# Altium schematic sheet MotorDriver_Schematics.SchDoc
size A3; SheetNumber: 2; SheetTotal: 3
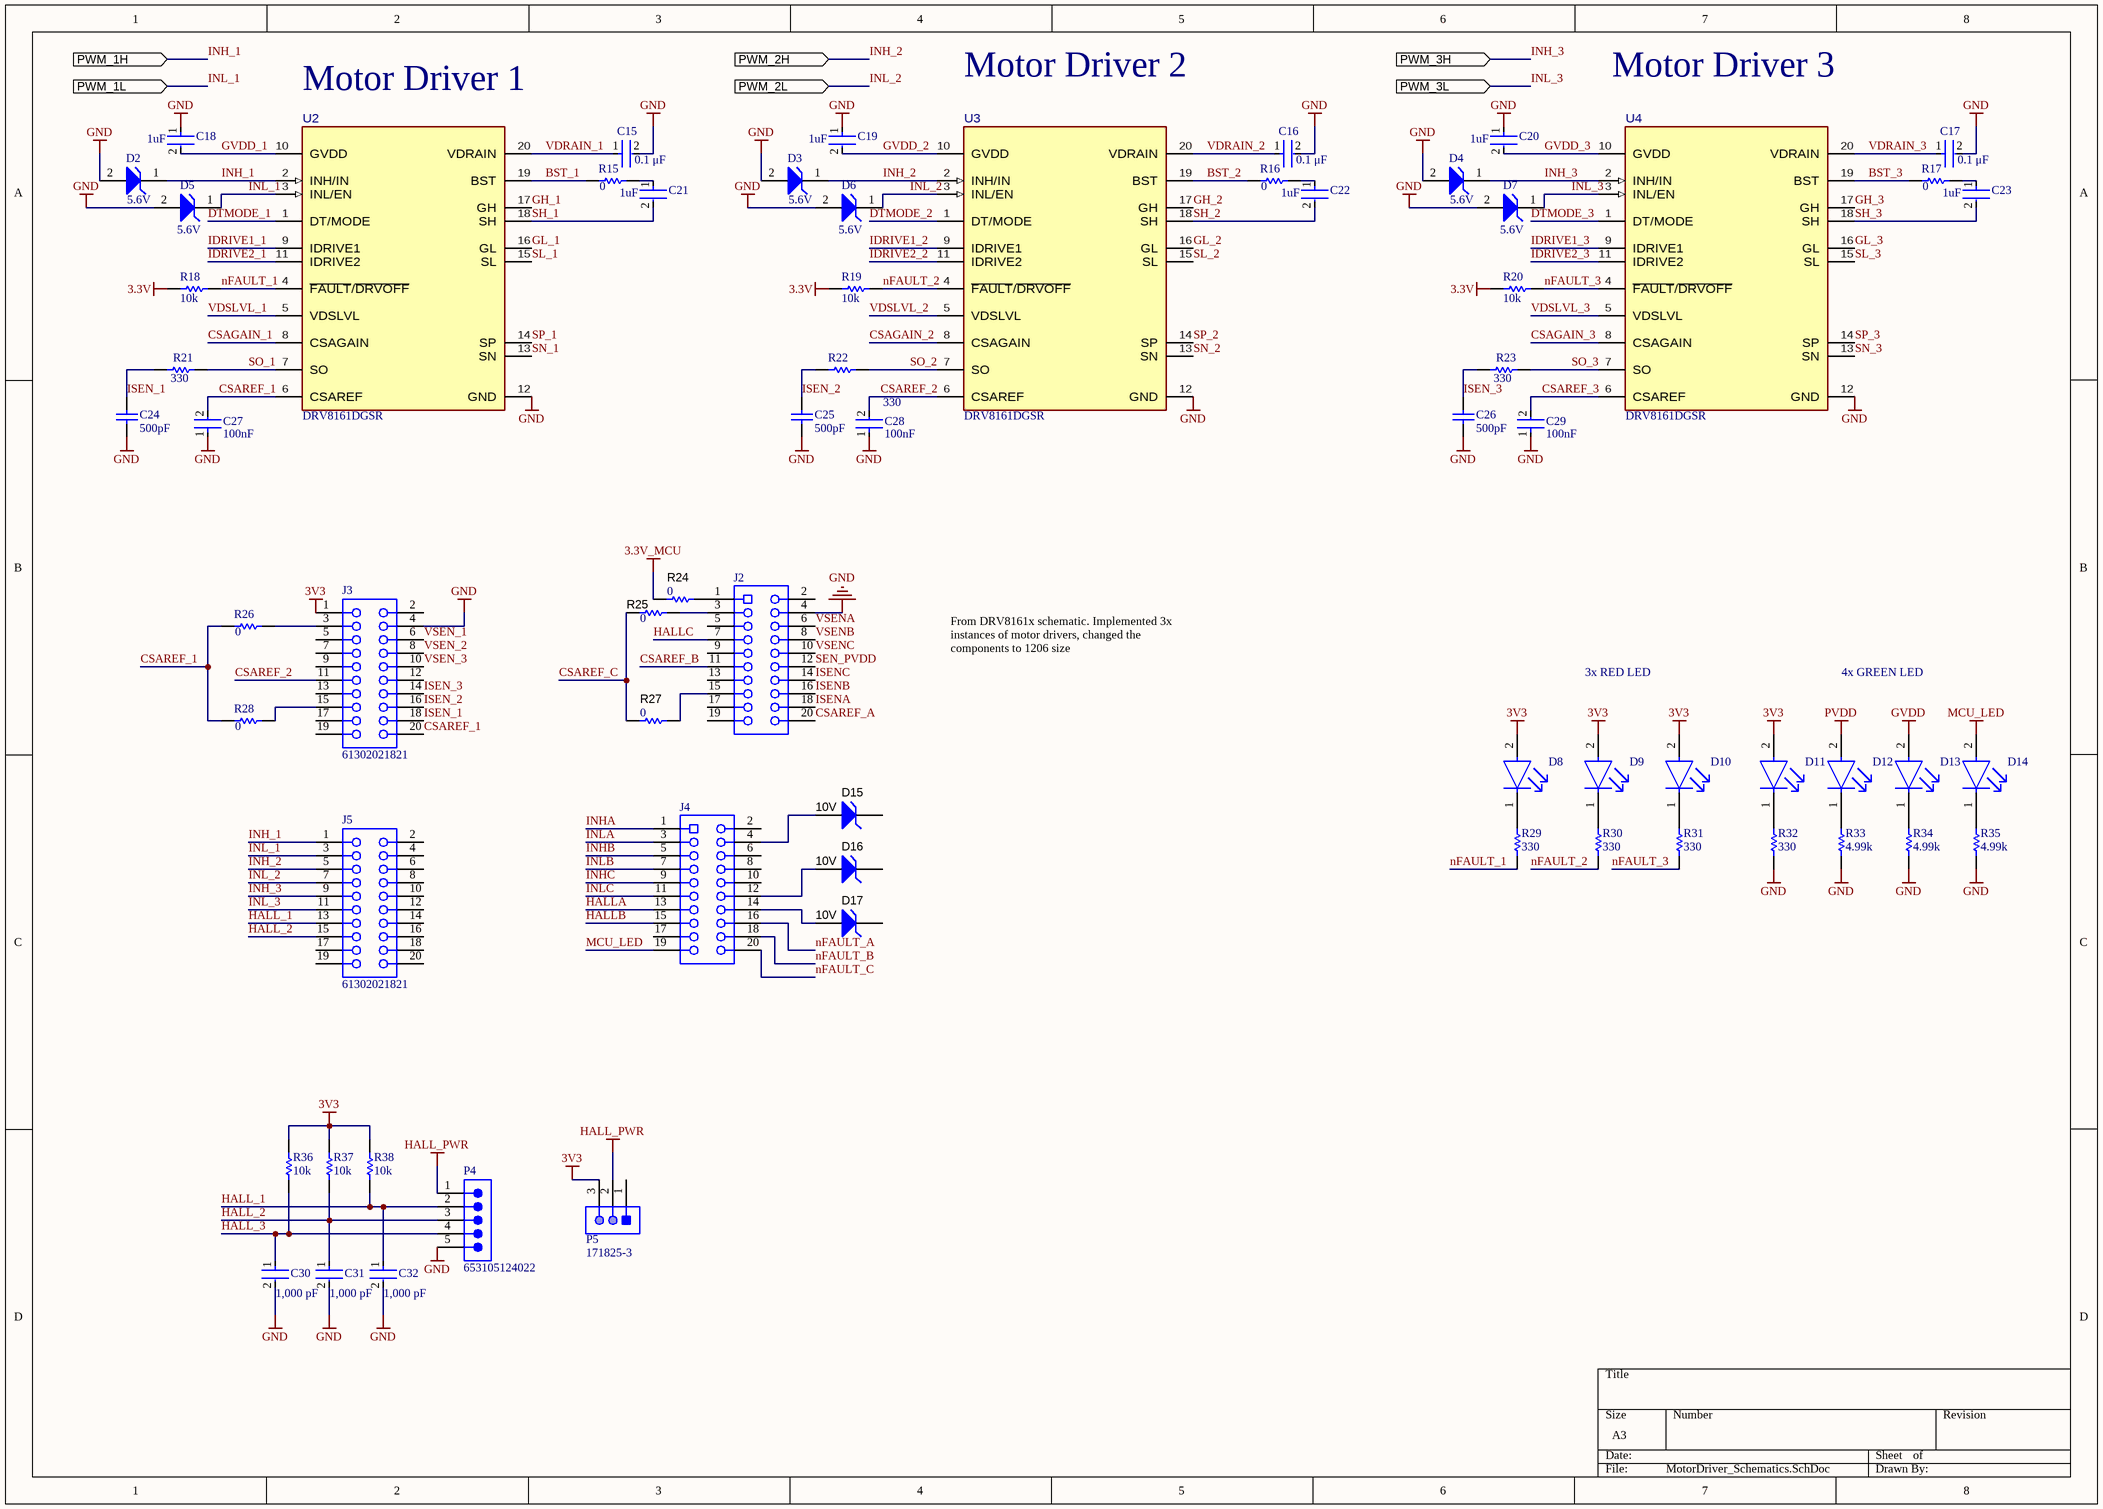
[diagram p0: MotorDriver_Schematics.SchDoc]

## Parts
C15  Capacitance: 0.1 μF  [FP-C1206C-EB-MFG]  (hidden comment: C1206C104K1RACTU)
C16  Capacitance: 0.1 μF  [FP-C1206C-EB-MFG]  (hidden comment: C1206C104K1RACTU)
C17  Capacitance: 0.1 μF  [FP-C1206C-EB-MFG]  (hidden comment: C1206C104K1RACTU)
C18  Capacitance: 1uF  [FP-1206-L_3_2_0_2-W_1_6_0-IPC_A]  (hidden comment: 12063C105KAT2A)
C19  Capacitance: 1uF  [FP-1206-L_3_2_0_2-W_1_6_0-IPC_A]  (hidden comment: 12063C105KAT2A)
C20  Capacitance: 1uF  [FP-1206-L_3_2_0_2-W_1_6_0-IPC_A]  (hidden comment: 12063C105KAT2A)
C21  Capacitance: 1uF  [FP-1206-L_3_2_0_2-W_1_6_0-IPC_A]  (hidden comment: 12063C105KAT2A)
C22  Capacitance: 1uF  [FP-1206-L_3_2_0_2-W_1_6_0-IPC_A]  (hidden comment: 12063C105KAT2A)
C23  Capacitance: 1uF  [FP-1206-L_3_2_0_2-W_1_6_0-IPC_A]  (hidden comment: 12063C105KAT2A)
C24  Parameter 1: 500pF  [CAPC1005X56X25NL10T15]  (hidden comment: 04025C501KAT2A)
C25  Parameter 1: 500pF  [CAPC1005X56X25NL10T15]  (hidden comment: 04025C501KAT2A)
C26  Parameter 1: 500pF  [CAPC1005X56X25NL10T15]  (hidden comment: 04025C501KAT2A)
C27  Capacitance: 100nF  [FP-1206-L_3_2_0_2-W_1_6_0-MFG]  (hidden comment: 12061C104KAZ2A)
C28  Capacitance: 100nF  [FP-1206-L_3_2_0_2-W_1_6_0-MFG]  (hidden comment: 12061C104KAZ2A)
C29  Capacitance: 100nF  [FP-1206-L_3_2_0_2-W_1_6_0-MFG]  (hidden comment: 12061C104KAZ2A)
C30  Capacitance: 1,000 pF  [FP-C1206C-EB-MFG]  (hidden comment: C1206C102J1GACTU)
C31  Capacitance: 1,000 pF  [FP-C1206C-EB-MFG]  (hidden comment: C1206C102J1GACTU)
C32  Capacitance: 1,000 pF  [FP-C1206C-EB-MFG]  (hidden comment: C1206C102J1GACTU)
D2  VZ Typ (V): 5.6V  [ONSC-SOD-123-2-425-04_V]  (hidden comment: MMSZ5232BT1G)
D3  VZ Typ (V): 5.6V  [ONSC-SOD-123-2-425-04_V]  (hidden comment: MMSZ5232BT1G)
D4  VZ Typ (V): 5.6V  [ONSC-SOD-123-2-425-04_V]  (hidden comment: MMSZ5232BT1G)
D5  VZ Typ (V): 5.6V  [ONSC-SOD-123-2-425-04_V]  (hidden comment: MMSZ5232BT1G)
D6  VZ Typ (V): 5.6V  [ONSC-SOD-123-2-425-04_V]  (hidden comment: MMSZ5232BT1G)
D7  VZ Typ (V): 5.6V  [ONSC-SOD-123-2-425-04_V]  (hidden comment: MMSZ5232BT1G)
D8  HSMS-C150  [FP-HSMS-C150-MFG]  (value not drawn)
D9  HSMS-C150  [FP-HSMS-C150-MFG]  (value not drawn)
D10  HSMS-C150  [FP-HSMS-C150-MFG]  (value not drawn)
D11  LTST-C171GKT  [FP-LTST-C171GKT-MFG]  (value not drawn)
D12  LTST-C171GKT  [FP-LTST-C171GKT-MFG]  (value not drawn)
D13  LTST-C171GKT  [FP-LTST-C171GKT-MFG]  (value not drawn)
D14  LTST-C171GKT  [FP-LTST-C171GKT-MFG]  (value not drawn)
D15  value 10V  [SOD-123]  (hidden comment: DDZ10C-7)
D16  value 10V  [SOD-123]  (hidden comment: DDZ10C-7)
D17  value 10V  [SOD-123]  (hidden comment: DDZ10C-7)
J2  SSQ-110-03-G-D  [Samtec_SSQ-110-03-x-D]  (value not drawn)
J3  61302021821  [61302021821]
J4  SSQ-110-03-G-D  [Samtec_SSQ-110-03-x-D]  (value not drawn)
J5  61302021821  [61302021821]
P4  653105124022  [653105124022]
P5  171825-3  [TECO-171825-3_V]
R15  Resistance: 0  [RESC3216X70X50NL05T20]  (hidden comment: ERJ-8GEY0R00V)
R16  Resistance: 0  [RESC3216X70X50NL05T20]  (hidden comment: ERJ-8GEY0R00V)
R17  Resistance: 0  [RESC3216X70X50NL05T20]  (hidden comment: ERJ-8GEY0R00V)
R18  Resistance: 10k  [RESC3116X65X50NL20T20]  (hidden comment: CRCW120610K0FKEAHP)
R19  Resistance: 10k  [RESC3116X65X50NL20T20]  (hidden comment: CRCW120610K0FKEAHP)
R20  Resistance: 10k  [RESC3116X65X50NL20T20]  (hidden comment: CRCW120610K0FKEAHP)
R21  Resistance: 330  [RESC3216X70X50NL05T20]  (hidden comment: ERJ-8GEYJ331V)
R22  Resistance: 330  [RESC3216X70X50NL05T20]  (hidden comment: ERJ-8GEYJ331V)
R23  Resistance: 330  [RESC3216X70X50NL05T20]  (hidden comment: ERJ-8GEYJ331V)
R24  ValueDisplayed: 0  [0603L]  (hidden comment: CRCW06030000Z0EA)
R25  ValueDisplayed: 0  [0603L]  (hidden comment: CRCW06030000Z0EA)
R26  Resistance: 0  [RESC3216X70X50NL05T20]  (hidden comment: ERJ-8GEY0R00V)
R27  ValueDisplayed: 0  [0603L]  (hidden comment: CRCW06030000Z0EA)
R28  Resistance: 0  [RESC3216X70X50NL05T20]  (hidden comment: ERJ-8GEY0R00V)
R29  Resistance: 330  [RESC3216X70X50NL05T20]  (hidden comment: ERJ-8GEYJ331V)
R30  Resistance: 330  [RESC3216X70X50NL05T20]  (hidden comment: ERJ-8GEYJ331V)
R31  Resistance: 330  [RESC3216X70X50NL05T20]  (hidden comment: ERJ-8GEYJ331V)
R32  Resistance: 330  [RESC3216X70X50NL05T20]  (hidden comment: ERJ-8GEYJ331V)
R33  Resistance: 4.99k  [RESC3216X60X45ML10T20]  (hidden comment: CRCW12064K99FKEA)
R34  Resistance: 4.99k  [RESC3216X60X45ML10T20]  (hidden comment: CRCW12064K99FKEA)
R35  Resistance: 4.99k  [RESC3216X60X45ML10T20]  (hidden comment: CRCW12064K99FKEA)
R36  Resistance: 10k  [RESC3116X65X50NL20T20]  (hidden comment: CRCW120610K0FKEAHP)
R37  Resistance: 10k  [RESC3116X65X50NL20T20]  (hidden comment: CRCW120610K0FKEAHP)
R38  Resistance: 10k  [RESC3116X65X50NL20T20]  (hidden comment: CRCW120610K0FKEAHP)
U2  DRV8161DGSR  [DGS0020A-MFG]
U3  DRV8161DGSR  [DGS0020A-MFG]
U4  DRV8161DGSR  [DGS0020A-MFG]

## Ports
PWM_1H (in), PWM_1L (in), PWM_2H (in), PWM_2L (in), PWM_3H (in), PWM_3L (in)

## Nets
3.3V: R18.1 R19.1 R20.1
3.3V_MCU: R24.1
3V3: D8.2(A) D9.2(A) D10.2(A) D11.2(A) J3.1 P5.3 R36.2 R37.2 R38.2
GND: C15.2 C16.2 C17.2 C18.1 C19.1 C20.1 C24.1 C25.1 C26.1 C27.1 C28.1 C29.1 C30.2 C31.2 C32.2 D2.2(A) D3.2(A) D4.2(A) D5.2(A) D6.2(A) D7.2(A) J2.4 J3.4 P4.5 R32.1 R33.1 R34.1 R35.1 U2.12(GND) U3.12(GND) U4.12(GND)
GVDD: D13.2(A)
HALL_PWR: P4.1 P5.2
MCU_LED: D14.2(A) J4.19
PVDD: D12.2(A)
BST_1: R15.1 U2.19(BST)
BST_2: R16.1 U3.19(BST)
BST_3: R17.1 U4.19(BST)
CSAGAIN_1: U2.8(CSAGAIN)
CSAGAIN_2: U3.8(CSAGAIN)
CSAGAIN_3: U4.8(CSAGAIN)
CSAREF_1: C27.2 J3.20 R26.1 R28.1 U2.6(CSAREF)
CSAREF_2: C28.2 J3.11 U3.6(CSAREF)
CSAREF_3: C29.2 U4.6(CSAREF)
CSAREF_A: J2.20
CSAREF_B: J2.11
CSAREF_C: R25.1 R27.1
DTMODE_1: U2.1(DT/MODE)
DTMODE_2: U3.1(DT/MODE)
DTMODE_3: U4.1(DT/MODE)
GH_1: U2.17(GH)
GH_2: U3.17(GH)
GH_3: U4.17(GH)
GL_1: U2.16(GL)
GL_2: U3.16(GL)
GL_3: U4.16(GL)
GVDD_1: C18.2 U2.10(GVDD)
GVDD_2: C19.2 U3.10(GVDD)
GVDD_3: C20.2 U4.10(GVDD)
HALL_1: C32.1 J5.13 P4.2 R38.1
HALL_2: C31.1 J5.15 P4.3 R37.1
HALL_3: C30.1 P4.4 R36.1
HALLA: J4.13
HALLB: J4.15
HALLC: J2.7
IDRIVE1_1: U2.9(IDRIVE1)
IDRIVE1_2: U3.9(IDRIVE1)
IDRIVE1_3: U4.9(IDRIVE1)
IDRIVE2_1: U2.11(IDRIVE2)
IDRIVE2_2: U3.11(IDRIVE2)
IDRIVE2_3: U4.11(IDRIVE2)
INH_1: D2.1(K) J5.1 U2.2(INH/IN) ; port PWM_1H
INH_2: D3.1(K) J5.5 U3.2(INH/IN) ; port PWM_2H
INH_3: D4.1(K) J5.9 U4.2(INH/IN) ; port PWM_3H
INHA: J4.1
INHB: J4.5
INHC: J4.9
INL_1: D5.1(K) J5.3 U2.3(INL/EN) ; port PWM_1L
INL_2: D6.1(K) J5.7 U3.3(INL/EN) ; port PWM_2L
INL_3: D7.1(K) J5.11 U4.3(INL/EN) ; port PWM_3L
INLA: J4.3
INLB: J4.7
INLC: J4.11
ISEN_1: C24.2 J3.18 R21.1
ISEN_2: C25.2 J3.16 R22.2
ISEN_3: C26.2 J3.14 R23.1
ISENA: J2.18
ISENB: J2.16
ISENC: J2.14
nFAULT_1: R18.2 R29.1 U2.4(~{FAULT}/~{DRVOFF})
nFAULT_2: R19.2 R30.1 U3.4(~{FAULT}/~{DRVOFF})
nFAULT_3: R20.2 R31.1 U4.4(~{FAULT}/~{DRVOFF})
nFAULT_A: J4.16
nFAULT_B: J4.18
nFAULT_C: J4.20
SEN_PVDD: J2.12
SH_1: C21.2 U2.18(SH)
SH_2: C22.2 U3.18(SH)
SH_3: C23.2 U4.18(SH)
SL_1: U2.15(SL)
SL_2: U3.15(SL)
SL_3: U4.15(SL)
SN_1: U2.13(SN)
SN_2: U3.13(SN)
SN_3: U4.13(SN)
SO_1: R21.2 U2.7(SO)
SO_2: R22.1 U3.7(SO)
SO_3: R23.2 U4.7(SO)
SP_1: U2.14(SP)
SP_2: U3.14(SP)
SP_3: U4.14(SP)
VDRAIN_1: C15.1 U2.20(VDRAIN)
VDRAIN_2: C16.1 U3.20(VDRAIN)
VDRAIN_3: C17.1 U4.20(VDRAIN)
VDSLVL_1: U2.5(VDSLVL)
VDSLVL_2: U3.5(VDSLVL)
VDSLVL_3: U4.5(VDSLVL)
VSEN_1: J3.6
VSEN_2: J3.8
VSEN_3: J3.10
VSENA: J2.6
VSENB: J2.8
VSENC: J2.10
NetC21_1: C21.1 R15.2
NetC22_1: C22.1 R16.2
NetC23_1: C23.1 R17.2
NetD8_1: D8.1(C) R29.2
NetD9_1: D9.1(C) R30.2
NetD10_1: D10.1(C) R31.2
NetD11_1: D11.1(C) R32.2
NetD12_1: D12.1(C) R33.2
NetD13_1: D13.1(C) R34.2
NetD14_1: D14.1(C) R35.2
NetD15_2: D15.2(A) J4.4
NetD16_2: D16.2(A) J4.12
NetD17_2: D17.2(A) J4.14
NetJ2_1: J2.1 R24.2
NetJ2_3: J2.3 R25.2
NetJ2_15: J2.15 R27.2
NetJ3_3: J3.3 R26.2
NetJ3_15: J3.15 R28.2

Not connected (* = marked no-connect by the designer): D15 1(K); D16 1(K); D17 1(K); J2 2 5 9 13 17 19; J3 2 5 7 9 12 13 17 19; J4 2 6 8 10 17; J5 2 4 6 8 10 12 14 16 17 18 19 20; P5 1

## Notes on the sheet
- Motor Driver 1
- Motor Driver 2
- Motor Driver 3
- From DRV8161x schematic. Implemented 3x instances of motor drivers, changed the components to 1206 size
- 3x RED LED
- 4x GREEN LED

## Library data of the parts
C15-C17 = CMP-03020-000153-1: CAP CER 0.1UF 100V X7R 1206; Manufacturer: KEMET; Value: 0.10 μF; Tolerance: 0.1; Material: Ceramic; Temperature Coefficient: 15%; Automotive Grade: Grade 0; Voltage Rating: 100 V; Automotive: Yes; Ipc Land Pattern Name: CAPC320160X78; Device Class L1: Passive Components; ComponentLink2Description: Datasheet; Temperature Range Low: -55°C; Category: Cap; Octopart: https://octopart.com/c1206c104k1ractu-kemet-89521; Height: 0.88mm; Lead Free: Yes; Digikey Description: CAP CER 0.1UF 100V X7R 1206; Mouser Description: CAP CER 0.1UF 100V X7R 1206; Device Class L3: Ceramic Capacitors; Device Class L2: Capacitors; ComponentLink2URL: https://content.kemet.com/datasheets/KEM_C1007_X8R_ULTRA_150C_SMD.pdf; Temperature Range High: +150°C; Temperature Characteristic: X7R; Manufacturer Part Number: C1206C104K1RACTU; RoHS: TRUE; Package: C1206C-EB; Temperature: -55°C to +150°C
C18-C23 = CMP-04427-000096-1: General Purpose Ceramic Capacitor, 1206, 1uF, 10%, X7R, 15%, 25V; Dissipation Factor: 3%; Insulation Resistance: 100GR; Case Code (Metric): 3216; Length: 3.2mm; Size: 1.78mm; Radiation Hardening: No; Construction: Flat; Packaging: Tape and Reel; Voltage Rating (DC): 25V; Case Code (Imperial): 1206; Package Quantity: 1; Tolerance: 10%; Voltage Rating: 25V; Lead Free: Lead Free; Height: 1.78mm; Thickness: 0.07inch; Width: 1.6mm; Dielectric: X7R; Voltage: 25V; Contact Plating: Tin; Min Operating Temperature: -55°C; Number of Pins: 2; Series: -; Depth: 1.6mm; REACH SVHC: No SVHC; Case/Package: 1206; RoHS Compliant: Yes; Max Operating Temperature: 125°C; Termination: SMD/SMT; Mount: Surface Mount
C24-C26 = CMP-2008-02932-1: Manufacturer: AVX Interconnect / Elco; Part Number: 04025C501KAT2A
C27-C29 = CMP-04427-004798-1: General Purpose Ceramic Capacitor, 1206, 100nF, 10%, X7R, 15%, 100V; Features: Soft Termination; Termination: SMD/SMT; Mount: Surface Mount; Tolerance: 10%; Voltage Rating: 100V; Length: 3.2mm; Case/Package: 1206; Case Code (Metric): 3216; RoHS Compliant: Yes; Package Quantity: 1; Max Operating Temperature: 125°C; Voltage Rating (DC): 100V; Min Operating Temperature: -55°C; Number of Pins: 2; Packaging: Tape and Reel; Width: 0.063inch; REACH SVHC: No SVHC; Lead Free: Lead Free; Construction: Flat; Radiation Hardening: No; Case Code (Imperial): 1206; Thickness: 0.05inch; Series: FLEXITERM®; Depth: 1.6mm; Dielectric: X7R
C30-C32 = CMP-03020-000955-1: Multilayer Ceramic Capacitor, C Series, 1000 Pf, - 5%, C0g / Np0, 100 V, 1206 [3216 Metric] Rohs Compliant: Yes; Manufacturer: KEMET; Voltage Rating: 100 V; Tolerance: 0.05; Automotive Grade: Grade 0; Temperature Coefficient: 15%; Value: 1,000 pF; Material: Ceramic; Ipc Land Pattern Name: CAPC320160X78; Octopart: https://octopart.com/c1206c102j1gactu-kemet-99808; Height: 0.88mm; Device Class L3: Ceramic Capacitors; Manufacturer Part Number: C1206C102J1GACTU; Digikey Description: Multilayer Ceramic Capacitor, C Series, 1000 Pf, - 5%, C0g / Np0, 100 V, 1206 [3216 Metric] Rohs Compliant: Yes; Package: C1206C-EB; Temperature: -55°C to +150°C; Category: Cap; Temperature Range High: +150°C; ComponentLink2Description: Datasheet; RoHS: TRUE; Temperature Range Low: -55°C; Device Class L1: Passive Components; Device Class L2: Capacitors; Lead Free: Yes; Automotive: Yes; ComponentLink2URL: https://content.kemet.com/datasheets/KEM_C1007_X8R_ULTRA_150C_SMD.pdf; Mouser Description: Multilayer Ceramic Capacitors MLCC - SMD/SMT 100volts 1000pF C0G 5%; Temperature Characteristic: C0G
D2-D7 = CMP-1060-00586-1: Zener Voltage Regulator, 500 mW, 2-Pin SOD-123, Pb-Free, Tape and Reel; Manufacturer: On Semiconductor; P Max (W): 0.5; ComponentLink3URL: http://www.onsemi.com/pub_link/Collateral/425-04.PDF; Packing: Tape and Reel; ComponentLink3Description: Package Specification; ComponentLink2URL: http://www.onsemi.com/pub_link/Collateral/MMSZ5221BT1-D.PDF; ComponentLink1URL: http://www.onsemi.com/; ComponentLink2Description: Datasheet; PackageReference: SOD-123-2-425-04; ComponentLink1Description: Manufacturer URL; PartNumber: MMSZ5232BT1G; PackageVersion: Rev. G, 10/2009; PackageDescription: 2-Pin SOD, Body 1.6 x 2.69 mm; Mounting Technology: Surface Mount; RoHS: Pb-Free; DatasheetVersion: Rev. 12
D8-D10 = CMP-21615-000001-1: LED RED DIFFUSED CHIP SMD; Luminous Intensity: 10mcd; Power Dissipation: 65mW; Viewing Angle: 170°; Number of Elements: 1; Forward Current: 20mA; Lens Color: White; Lens Style: Rectangular; Wavelength: 626nm; Forward Voltage: 2.1V; Reverse Voltage: 5V; Number of Pins: 2; Color: Red; Lead Free: Lead Free; Width: 1.6mm; Length: 3.2mm; REACH SVHC: No SVHC; Height: 1.1mm; Depth: 1.6mm; Power Rating: 65mW; Package Quantity: 1; Illumination Color: Red; Radiation Hardening: No; Case Code (Imperial): 1206; Max Operating Temperature: 85°C; Test Current: 20mA; Case/Package: 1206; Lens Transparency: Diffused; Number of LEDs: 1; Packaging: Tape and Reel; Mount: Surface Mount; Min Operating Temperature: -40°C; Case Code (Metric): 3216; Dominant Wavelength: 626nm
D11-D14 = CMP-22017-000007-1: LED GREEN CLEAR CHIP SMD; Luminous Intensity: 12mcd; Lens Color: Colorless; Dominant Wavelength: 569nm; Number of LEDs: 1; Power Dissipation: 100mW; Viewing Angle: 130°; Reverse Voltage: 5V; Test Current: 10mA; Forward Voltage: 2.1V; Wavelength: 585nm; Lens Style: Diffused; Forward Current: 30mA; Height: 0.8mm; Mount: Surface Mount; Package Quantity: 1; Length: 2mm; Case Code (Metric): 2012; Number of Pins: 2; Number of Elements: 1; Packaging: Tape and Reel; Color: Green; Min Operating Temperature: -55°C; Case/Package: 0805; Power Rating: 100mW; Max Operating Temperature: 85°C; Radiation Hardening: No; Depth: 1.25mm; Lens Transparency: Clear; Width: 1.25mm; Lead Free: Lead Free; Case Code (Imperial): 0805; Illumination Color: Green
D15-D17 = CMP-0085118-1: Diode, Zener, 10 V, 500 mW, SOD-123; Manufacturer: Diodes Inc.; SizeY_mm: 1.7; SizeZ_mm: 1.35; AEC Qualified: N; Power_W: 500mW; AEC Category: Q101; SizeX_mm: 3.85; SizeAreaWB_mm2: 13.095; SizeArea_mm2: 6.545; Value1: 0.5W; RJA_CperW: 425; PackageReference: SOD-123; ComponentLink1Description: Datasheet link; CompType: Zener; Vz_V: 10V; RoHS: Y; MountType: SMT; ComponentLink1URL: https://www.diodes.com/assets/Datasheets/Ds30407.pdf; PartNumber: DDZ10C-7
J2 J4 = CMP-0075613-1: Receptacle, 2.54mm, 10x2, Gold, TH; Manufacturer: Samtec; Pitch_mm: 2.54; Cert_VDE: N; Gender: Female; Cert_CSA: Y; Current_A: 6.3A; Voltage_V: 550V; CT: True; Row_Count: 2; CompType: Socket Strip; CNHeader: False; ComponentLink1Description: Datasheet URL; RoHS: Y; Cert_UL: Y; Orientation: Vertical; PackageReference: Receptacle, 2.54mm, 10x2, TH; Color: Black; PartNumber: SSQ-110-03-G-D; PinCount: 20; Publisher: Texas Instruments; ContactFinish: Gold; Cert_CULUS: N; RowSpacing_mm: 2.54; ComponentLink1URL: https://www.samtec.com/ftppub/cpdf/SSQ-1XX-XX-XXX-X-XX-XXX-XX-X-MKT.pdf; LatestRevisionDate: 2017-07-12; MountType: TH
J3 J5 = CMP-1502-01350-3: NexarPartId: 61924746; Current Rating: 3A; Operating Supply Voltage: 250V; Gender: Female; Contact Resistance: 20mΩ; RoHS: Non-Compliant; Orientation: Vertical; Number of Pins: 20; Lead Pitch: 2.54mm
P4 = CMP-1502-00760-2: NexarPartId: 18818279; Contact Resistance: 20mΩ; Number of Contacts: 5; Pitch: 1.25mm; Gender: Male; Operating Supply Voltage: 125V; Insulation Resistance: 100MΩ; Insulation: Insulated; Current Rating: 1A; Connector Type: Male Pin; Orientation: Vertical; Contact Material: Copper; Contact Mating Length: 2.159mm; REACH SVHC: Unknown; Contact Gender: Male; Length: 11mm; Min Operating Temperature: -40°C; Width: 11mm; Lead Pitch: 1.25mm; RoHS: Compliant; Height: 4.75mm; Number of Pins: 5; Color: Beige, White; Flammability Rating: UL94 V-0; Mount: Surface Mount; Packaging: Tape and Reel; Number of Rows: 1; Termination: SMD/SMT; Max Operating Temperature: 85°C; Contact Plating: Tin; Housing Material: Nylon; Number of Positions: 5; Voltage Rating: 125V
P5 = CMP-2000-07494-1: Male Header, Pitch 2.5 mm, 1 x 3 Position, Height 10.4 mm, Tail Length 3.6 mm, / -20 to 95 degC / , RoHS, Bulk; Manufacturer: TE Connectivity; Mating Alignment: Yes(With); Tail Length: 0.142inch; Mating Post Length: 7.5mm; PCB Thickness: 0.063inch; PCB Mount Alignment: No(Without); Voltage Rating: 350V; Max Voltage Rating (AC): 250V; Plating Thickness: 0.8um; PCB Mounting Orientation: Vertical; Number of Positions: 3; PCB Mount Retention: Without; Max Current Rating: 3.5A; Max Voltage Rating (DC): 350.25kV; Pitch: 2.5mm; Approvals: UL; Contact Resistance: 20mOhm; Mount: ThroughHole; Length: 7.5mm; Orientation: Straight; Contact Mating Length: 0.295inch; Contact Material: Brass; Housing Material: Nylon; Package Description: Male Header, Pitch 2.5 mm, 1 x 3 Position, Height 10.4 mm, Tail Length 3.6 mm; Colour: Natural; Backwall/Post Interruptions: No(Without); Min Operating Temperature: -20degC; Mating Retention: Yes(With); Connector Type: Header; Packaging: Bag; RoHSCompliant: True; Package Reference: 171825-3; Contact Shape: Square; Strain Relief: No(Without); Contact Gender: Male; Number of Contacts: 3; Manufacturer URL: http://www.te.com/; Height: 0.409inch; Contact Retention: No(Without); Datasheet Version: Rev. Y3, 12/2016; Panel Mount Retention: No(Without); Datasheet URL: http://www.te.com/commerce/DocumentDelivery/DDEController?Action=showdoc&DocId=Customer+Drawing%7F171825%7FY3%7Fpdf%7FEnglish%7FENG_CD_171825_Y3.pdf%7F171825-3; Termination: Solder; Mounting Technology: ThroughHole; Max Operating Temperature: 95degC; Flammability Rating: UL94V-0; REACH SVHC: NoSVHC; Housing Colour: Natural; Package Quantity: 1000; Number of Rows: 1; Depth: 4.9mm; Contact Plating: Tin
R15-R17 R26 R28 = CMP-2003-00541-1: Manufacturer: Panasonic; Part Number: ERJ-8GEY0R00V
R18-R20 R36-R38 = CMP-2003-04883-1: Manufacturer: Vishay Dale; Part Number: CRCW120610K0FKEAHP
R21-R23 R29-R32 = CMP-2003-00612-1: Manufacturer: Panasonic; Part Number: ERJ-8GEYJ331V
R24 R25 R27 = CMP-0025697-4: RES, 0, 5%, 0.1 W, AEC-Q200 Grade 0, 0603; Manufacturer: Vishay-Dale; Power_W: 100mW; TempCo: 200 ppm/C; Value_Code: 0000; Value: 0; EIA_Code: E24; SizeX_mm: 1.6; SizeY_mm: 0.8; SizeZ_mm: 1; Value2: 0.1W; SizeArea_mm2: 1.28; AEC Qualified: Y; VDC_V: 75V; AEC Category: Q200; Supplier Part Number 2: 52K8014; Supplier 2: Newark; Supplier Part Number 3: 71-CRCW0603-0-E3; Supplier 3: Mouser; RoHS: E; Value1: 5%; MountType: SMT; Supplier 1: Digi-Key; PackageReference: 0603; Tolerance_%: 5%; Res_ohm: 0; CompType: Resistor; PartNumber: CRCW06030000Z0EA; ComponentLink1Description: Datasheet link; Supplier Part Number 1: 541-0.0GCT-ND; Technology: Thick Film; ComponentLink1URL: http://www.vishay.com/docs/20035/dcrcwe3.pdf; AEC Grade: 0
R33-R35 = CMP-2003-02241-1: Manufacturer: Vishay Dale; Part Number: CRCW12064K99FKEA
U2-U4 = CMP-0001362-1: 100-V Half-Bridge Smart Gate Driver; Manufacturer: Texas Instruments; SizeZ_mm: 1.1mm; AEC Qualified: No; Max Supply Voltage: 20V; Min Supply Voltage: 8V; Motor Type: Brushless DC; Nominal Supply Current: 1-4mA; Number Of Outputs: 2; Standoff Height: 0.05mm; TaMax_C: +125°C; TaMin_C: -40°C; TJmax_C: +150°C; PackageReference: VSSOP20; PartNumber: DRV8161DGSR; RoHS: UNKNOWN; Operating Temperature Range: -40°C to +150°C; Part Number: DRV8161DGSR; Datasheet Path: datasheets/IC-DRV8161DGSR.pdf; helpURL: https://upverter.com/upn/revision/8c360e89846b0b8d/